# Altium schematic sheet Peripherals.SchDoc
size A4; Revision: B.1(PCB.SCH)
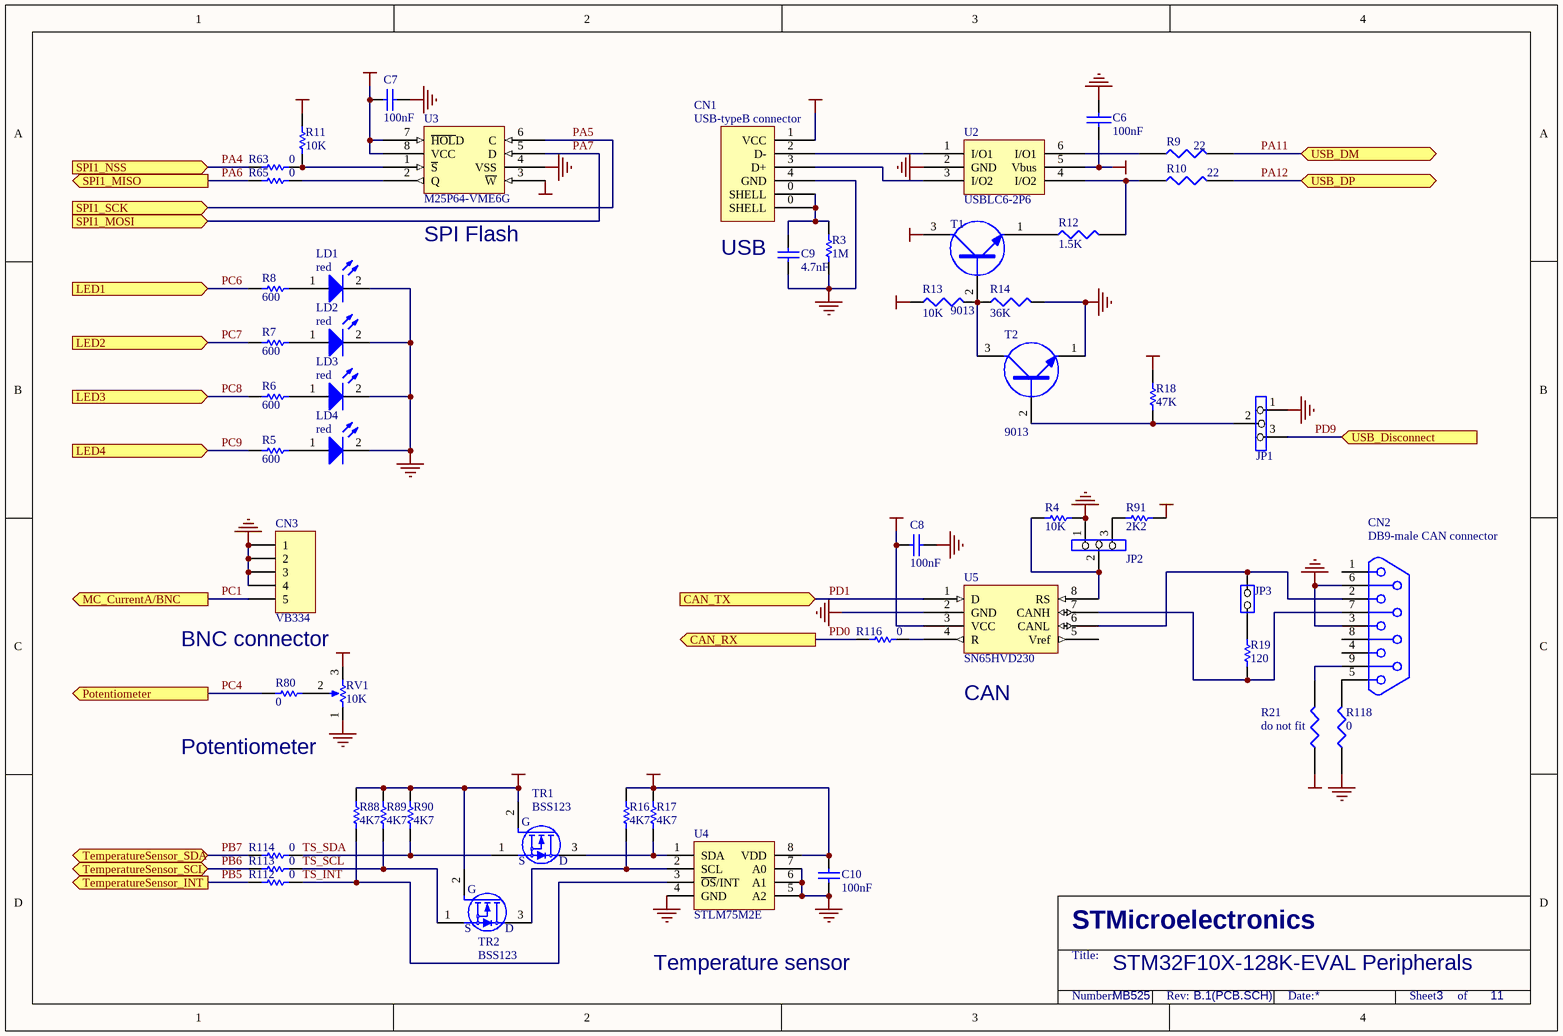
[diagram p0: Peripherals.SchDoc]

## Parts
C6  100nF  [0603P]
C7  100nF  [0603P]
C8  100nF  [0603P]
C9  4.7nF  [0603]
C10  100nF  [0603P]
CN1  USB-typeB connector  [USB-B]
CN2  DB9-male CAN connector  [DB9/M]
CN3  VB334  [VB334]
JP1  (no value)  [SIP3]
JP2  (no value)  [SIP3]
JP3  (no value)  [SIP2]
LD1  red  [D0603]
LD2  red  [D0603]
LD3  red  [D0603]
LD4  red  [D0603]
R3  1M  [0603]
R4  10K  [0603]
R5  600  [0805]
R6  600  [0805]
R7  600  [0805]
R8  600  [0805]
R9  22  [0603]
R10  22  [0603]
R11  10K  [0603]
R12  1.5K  [0603]
R13  10K  [0603]
R14  36K  [0603]
R16  4K7  [0603]
R17  4K7  [0603]
R18  47K  [0603]
R19  120  [0603]
R21  do not fit  [0603]
R63  0  [0805]
R65  0  [0805]
R80  0  [0805]
R88  4K7  [0603]
R89  4K7  [0603]
R90  4K7  [0603]
R91  2K2  [0603]
R112  0  [0805]
R113  0  [0805]
R114  0  [0805]
R116  0  [0805]
R118  0  [0603]
RV1  10K  [ADJRH]
T1  9013  [SOT-23]
T2  9013  [SOT-23]
TR1  BSS123  [SOT-23]
TR2  BSS123  [SOT-23]
U2  USBLC6-2P6  [SOT-666]
U3  M25P64-VME6G  [VDFPN8(8*6)]
U4  STLM75M2E  [SO8]
U5  SN65HVD230  [SO8]

## Ports
CAN_RX (out), CAN_TX (in), LED1 (in), LED2 (in), LED3 (in), LED4 (in), MC_CurrentA/BNC (out), Potentiometer (out), SPI1_MISO (out), SPI1_MOSI (in), SPI1_NSS (in), SPI1_SCK (in), TemperatureSensor_INT (out), TemperatureSensor_SCL (bidir), TemperatureSensor_SDA (bidir), USB_Disconnect (in), USB_DM (bidir), USB_DP (bidir)

## Nets
+3V3: C7.2 C8.2 R11.2 R18.2 R21.1 R88.2 R89.2 R90.2 R91.2 RV1.3(TOP) T1.3(C) TR1.2(G) TR2.2(G) U3.3(~{W}) U3.7(~{HOL}D) U3.8(VCC) U5.3(VCC)
+5V: C10.2 R16.2 R17.2 U4.8(VDD)
GND: C6.1 C7.1 C8.1 C9.1 C10.1 CN1.4(GND) CN2.3 CN2.6 CN3.1 CN3.2 CN3.3 CN3.4 JP1.1 JP2.1 LD1.2(K) LD2.2(K) LD3.2(K) LD4.2(K) R3.1 R4.2 R14.2 R118.1 RV1.1(BOT) T2.1(E) U2.2(GND) U3.4(VSS) U4.4(GND) U4.5(A2) U4.6(A1) U4.7(A0) U5.2(GND)
U5V: C6.2 CN1.1(VCC) R13.1 U2.5(Vbus)
PA4: R63.2 ; port SPI1_NSS
PA5: U3.6(C) ; port SPI1_SCK
PA6: R65.1 ; port SPI1_MISO
PA7: U3.5(D) ; port SPI1_MOSI
PA11: R9.2 ; port USB_DM
PA12: R10.2 ; port USB_DP
PB5: R112.2 ; port TemperatureSensor_INT
PB6: R113.2 ; port TemperatureSensor_SCL
PB7: R114.2 ; port TemperatureSensor_SDA
PC1: CN3.5 ; port MC_CurrentA/BNC
PC4: R80.1 ; port Potentiometer
PC6: R8.2 ; port LED1
PC7: R7.2 ; port LED2
PC8: R6.2 ; port LED3
PC9: R5.2 ; port LED4
PD0: R116.2 ; port CAN_RX
PD1: U5.1(D) ; port CAN_TX
PD9: JP1.3 ; port USB_Disconnect
TS_INT: R88.1 R112.1 U4.3(~{OS}/INT)
TS_SCL: R89.1 R113.1 TR2.1(S)
TS_SDA: R90.1 R114.1 TR1.1(S)
NetC9_2: C9.2 CN1.0(SHELL) R3.2
NetCN1_2: CN1.2(D-) U2.1(I/O1)
NetCN1_3: CN1.3(D+) U2.3(I/O2)
NetCN2_2: CN2.2 JP3.2(NO) U5.6(CANL)
NetCN2_5: CN2.5 R118.2
NetCN2_7: CN2.7 R19.1 U5.7(CANH)
NetCN2_9: CN2.9 R21.2
NetJP1_2: JP1.2 R18.1 T2.2(B)
NetJP2_2: JP2.2 R4.1 U5.8(RS)
NetJP2_3: JP2.3 R91.1
NetJP3_1: JP3.1(COMMON) R19.2
NetLD1_1: LD1.1(A) R8.1
NetLD2_1: LD2.1(A) R7.1
NetLD3_1: LD3.1(A) R6.1
NetLD4_1: LD4.1(A) R5.1
NetR9_1: R9.1 U2.6(I/O1)
NetR10_1: R10.1 R12.2 U2.4(I/O2)
NetR11_1: R11.1 R63.1 U3.1(~{S})
NetR12_1: R12.1 T1.1(E)
NetR13_2: R13.2 R14.1 T1.2(B) T2.3(C)
NetR16_1: R16.1 TR2.3(D) U4.2(SCL)
NetR17_1: R17.1 TR1.3(D) U4.1(SDA)
NetR65_2: R65.2 U3.2(Q)
NetR80_2: R80.2 RV1.2(TAP)
NetR116_1: R116.1 U5.4(R)

Not connected (* = marked no-connect by the designer): CN2 1 4 8; U5 5(Vref)

## Notes on the sheet
- (near U3) SPI Flash
- USB
- BNC connector
- (near U5) CAN
- Potentiometer
- Temperature sensor
- STM32F10X-128K-EVAL Peripherals
- MB525
- 3
- 11
- STMicroelectronics
- Title:
- Number:
- Rev:
- Date:
- Sheet       of

## Library data of the parts
C6-C8 = CAP: Capacitor
  C7 C8: Published: 8-Jun-2000; Revision: July-2002: Re-released for DXP Platform.; Publisher: Altium Limited; Value: 100nF
C9 = CAP: Capacitor; Value: 100pF; Published: 8-Jun-2000; Revision: July-2002: Re-released for DXP Platform.; Publisher: Altium Limited
C10 = cap: Capacitor; Value: 100pF; Published: 8-Jun-2000; Revision: July-2002: Re-released for DXP Platform.; Publisher: Altium Limited
CN1 = USB-B
CN2 = DB9
CN3 = Header 5: Header, 5-Pin; Revision: 17-Jul-2002: Re-released for DXP Platform.; Publisher: Altium Limited
JP1 JP2 = Jumper3
JP3 = JP2
LD1-LD4 = LED2: Typical RED, GREEN, YELLOW, AMBER GaAs LED; Published: 8-Jun-2000; Revision: July-2002: Re-released for DXP Platform.; Publisher: Altium Limited
R3 R5-R8 R11 R16-R18 R63 R65 R80 R88-R90 R112-R114 R116 = Res1: Resistor; Value: 1K; Published: 8-Jun-2000; Revision: July-2002: Re-released for DXP Platform.; Publisher: Altium Limited
R4 R19 R91 = res1: Resistor; Value: 1K; Published: 8-Jun-2000; Revision: July-2002: Re-released for DXP Platform.; Publisher: Altium Limited
R9 R10 R12 R21 R118 = RES1
R13 R14 = R: Right: 20; Bottom: 30
RV1 = RV
T1 T2 = NPN
TR1 TR2 = 2N7000
U2 = USBLC6-2
U4 = STLM75DW2F
U5 = SN65HVD230D